# EAGLE schematic composition (EAGLE 7.7.0)
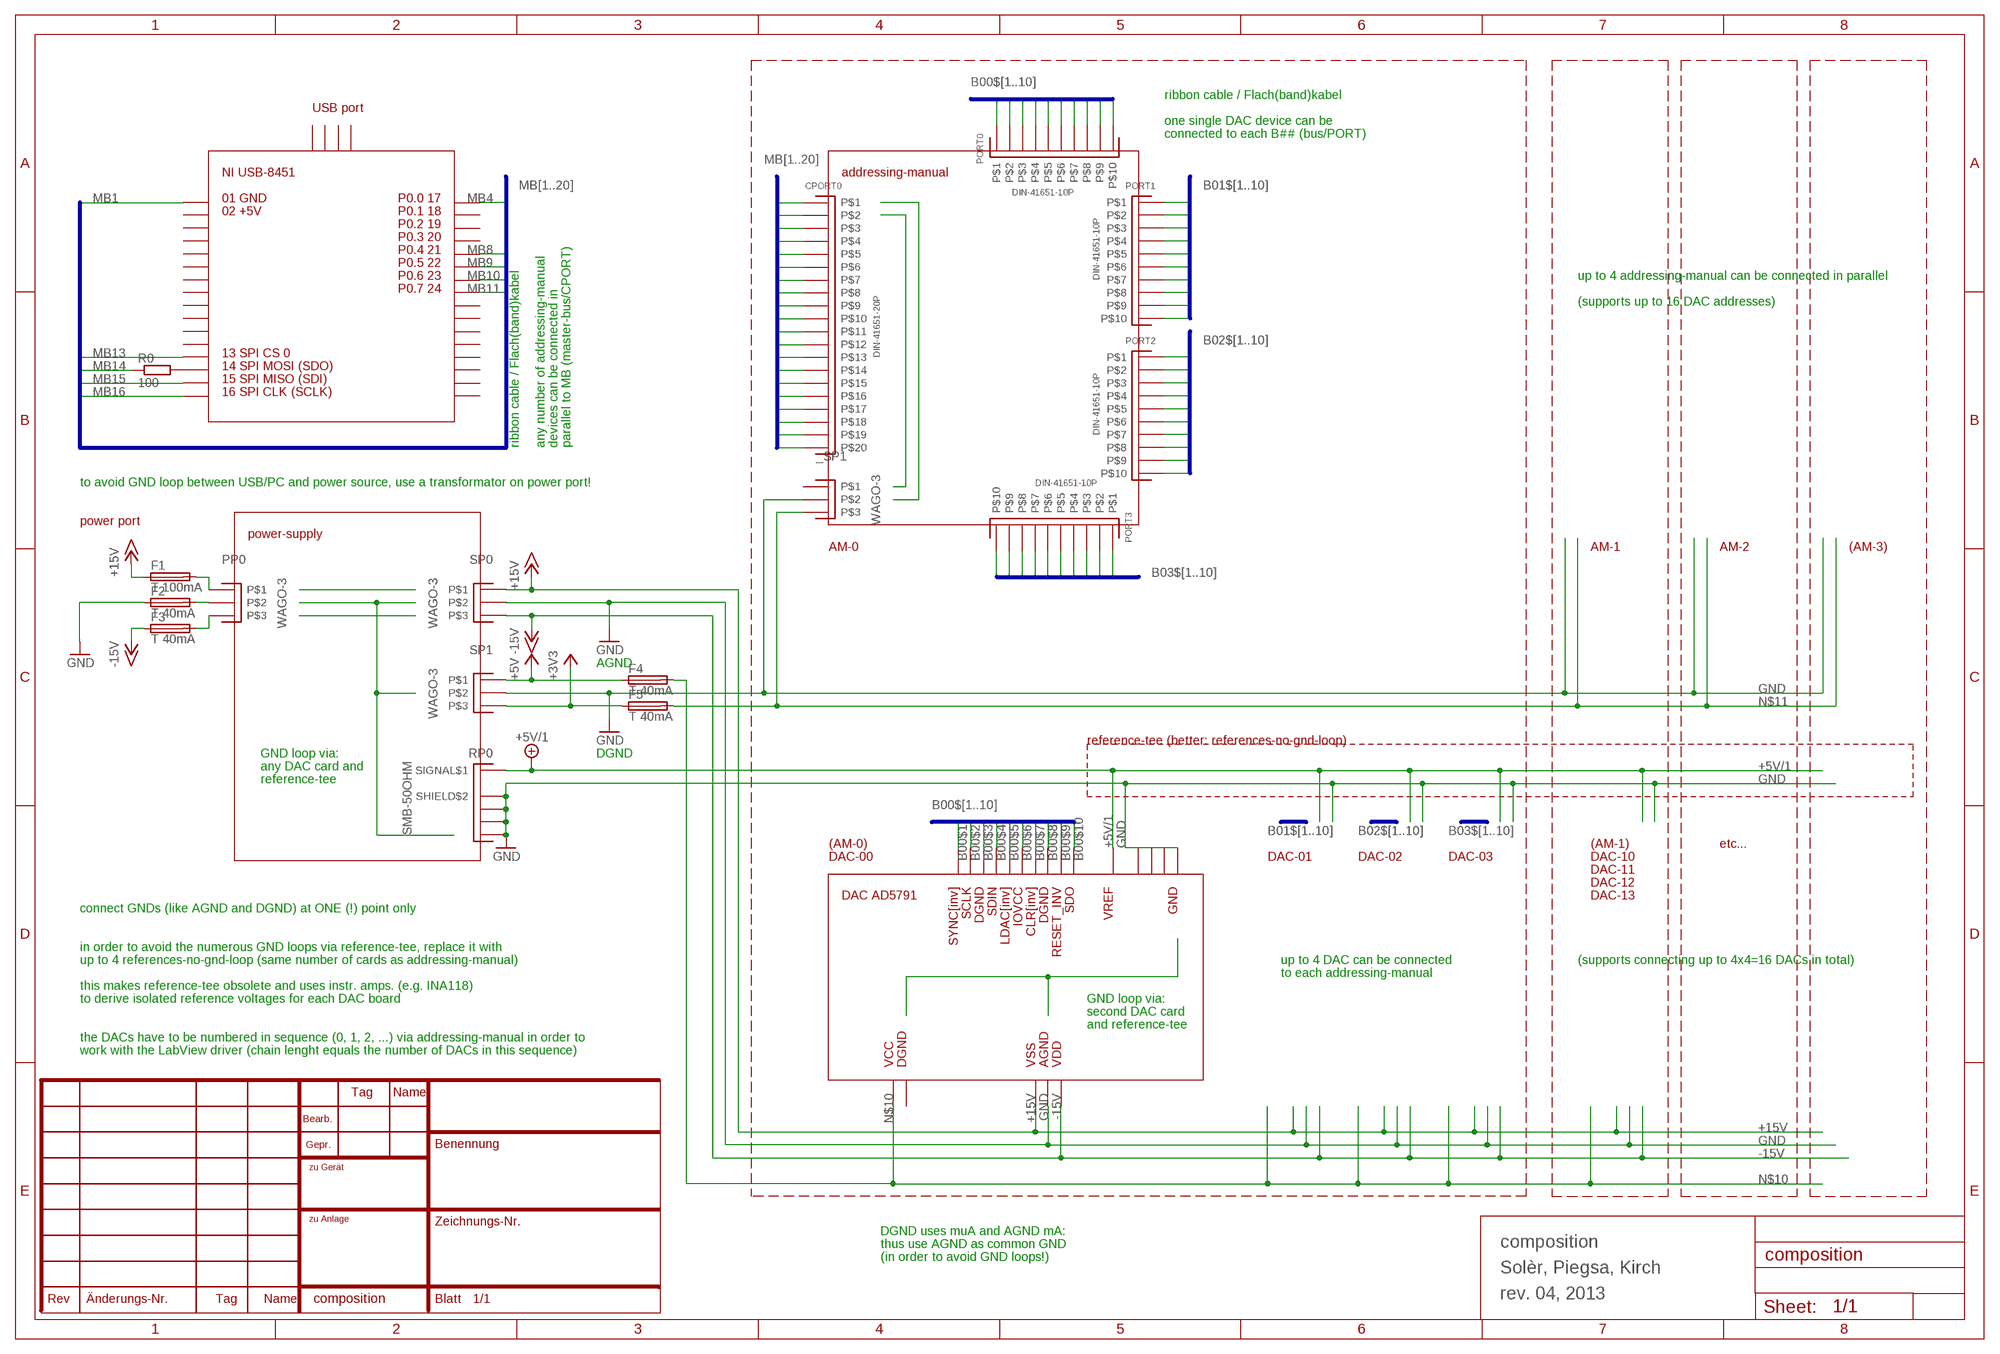
[diagram p0: schematic, sheet 1]

## Parts
_SP1  WAGO-3  [WAGO-3]
CPORT0  DIN-41651-20P  [DIN-41651-20P]
F1  T 100mA  FUSEBLANK_5X20MM  [FUSE_HOLDER_5X20MM]
F2  T 40mA  FUSEBLANK_5X20MM  [FUSE_HOLDER_5X20MM]
F3  T 40mA  FUSEBLANK_5X20MM  [FUSE_HOLDER_5X20MM]
F4  T 40mA  FUSEBLANK_5X20MM  [FUSE_HOLDER_5X20MM]
F5  T 40mA  FUSEBLANK_5X20MM  [FUSE_HOLDER_5X20MM]
PORT0  DIN-41651-10P  [DIN-41651-10P]
PORT1  DIN-41651-10P  [DIN-41651-10P]
PORT2  DIN-41651-10P  [DIN-41651-10P]
PORT3  DIN-41651-10P  [DIN-41651-10P]
PP0  WAGO-3  [WAGO-3]
R0  100  R-EU_0207/12  [0207/12]
RP0  SMB-50OHM  [B-30]
SP0  WAGO-3  [WAGO-3]
SP1  WAGO-3  [WAGO-3]

## Nets
+3V3: F5.1 SP1.P$3
+5V: F4.1 SP1.P$1
+5V/1: RP0.P$1(SIGNAL$1)
+15V: F1.1 SP0.P$1
-15V: F3.1 SP0.P$3
B00$1: PORT0.P$1
B00$2: PORT0.P$2
B00$3: PORT0.P$3
B00$4: PORT0.P$4
B00$5: PORT0.P$5
B00$6: PORT0.P$6
B00$7: PORT0.P$7
B00$8: PORT0.P$8
B00$9: PORT0.P$9
B00$10: PORT0.P$10
B01$1: PORT1.P$1
B01$2: PORT1.P$2
B01$3: PORT1.P$3
B01$4: PORT1.P$4
B01$5: PORT1.P$5
B01$6: PORT1.P$6
B01$7: PORT1.P$7
B01$8: PORT1.P$8
B01$9: PORT1.P$9
B01$10: PORT1.P$10
B02$1: PORT2.P$1
B02$2: PORT2.P$2
B02$3: PORT2.P$3
B02$4: PORT2.P$4
B02$5: PORT2.P$5
B02$6: PORT2.P$6
B02$7: PORT2.P$7
B02$8: PORT2.P$8
B02$9: PORT2.P$9
B02$10: PORT2.P$10
B03$1: PORT3.P$1
B03$2: PORT3.P$2
B03$3: PORT3.P$3
B03$4: PORT3.P$4
B03$5: PORT3.P$5
B03$6: PORT3.P$6
B03$7: PORT3.P$7
B03$8: PORT3.P$8
B03$9: PORT3.P$9
B03$10: PORT3.P$10
GND: _SP1.P$2 F2.1 RP0.P$2(SHIELD$2) RP0.P$3(SHIELD$3) RP0.P$4(SHIELD$4) RP0.P$5(SHIELD$5) SP0.P$2 SP1.P$2
MB1: CPORT0.P$1
MB2: CPORT0.P$2
MB3: CPORT0.P$3
MB4: CPORT0.P$4
MB5: CPORT0.P$5
MB6: CPORT0.P$6
MB7: CPORT0.P$7
MB8: CPORT0.P$8
MB9: CPORT0.P$9
MB10: CPORT0.P$10
MB11: CPORT0.P$11
MB12: CPORT0.P$12
MB13: CPORT0.P$13
MB14: CPORT0.P$14 R0.1
MB15: CPORT0.P$15
MB16: CPORT0.P$16
MB17: CPORT0.P$17
MB18: CPORT0.P$18
MB19: CPORT0.P$19
MB20: CPORT0.P$20
N$7: F1.2 PP0.P$1
N$8: F2.2 PP0.P$2
N$9: F3.2 PP0.P$3
N$10: F4.2
N$11: _SP1.P$3 F5.2
Unconnected: _SP1.P$1 R0.2

## Buses
B01$[1..10]
B02$[1..10]
B03$[1..10]
MB[1..20]
B00$[1..10]

## Notes on the sheet
- ribbon cable / Flach(band)kabel
- USB port
- one single DAC device can be
- connected to each B## (bus/PORT)
- NI USB-8451 | addressing-manual
- 01 GND | P0.0 17
- 02 +5V | P0.1 18
- P0.2 19
- P0.3 20
- P0.4 21
- P0.5 22
- P0.6 23 | up to 4 addressing-manual can be connected in parallel
- P0.7 24
- (supports up to 16 DAC addresses)
- 13 SPI CS 0
- 14 SPI MOSI (SDO)
- 15 SPI MISO (SDI)
- 16 SPI CLK (SCLK)
- ribbon cable / Flach(band)kabel | any number of addressing-manual | devices can be connected in | parallel to MB (master-bus/CPORT)
- to avoid GND loop between USB/PC and power source, use a transformator on power port!
- power port
- power-supply
- AM-0 | AM-1 | AM-2 | (AM-3)
- AGND
- reference-tee (better: references-no-gnd-loop)
- GND loop via: | DGND
- any DAC card and
- reference-tee
- (AM-0) | (AM-1) | etc...
- DAC-00 | DAC-01 | DAC-02 | DAC-03 | DAC-10
- DAC-11
- SYNC[inv] | SCLK | DGND | SDIN | LDAC[inv] | IOVCC | CLR[inv] | DGND | RESET_INV | SDO | VREF | GND | DAC-12
- DAC AD5791 | DAC-13
- connect GNDs (like AGND and DGND) at ONE (!) point only
- in order to avoid the numerous GND loops via reference-tee, replace it with
- up to 4 references-no-gnd-loop (same number of cards as addressing-manual) | up to 4 DAC can be connected | (supports connecting up to 4x4=16 DACs in total)
- to each addressing-manual
- this makes reference-tee obsolete and uses instr. amps. (e.g. INA118)
- to derive isolated reference voltages for each DAC board | GND loop via:
- second DAC card
- and reference-tee
- the DACs have to be numbered in sequence (0, 1, 2, ...) via addressing-manual in order to
- work with the LabView driver (chain lenght equals the number of DACs in this sequence)
- VCC | DGND | VSS | AGND | VDD
- DGND uses muA and AGND mA:
- thus use AGND as common GND | composition
- (in order to avoid GND loops!)
- Solèr, Piegsa, Kirch
- rev. 04, 2013

## Library data of the parts
_SP1 PP0 SP0 SP1 = parts:WAGO-3
CPORT0 = parts:DIN-41651-20P
F1-F5 = fuse:FUSE: Fuse; OC_FARNELL: unknown; OC_NEWARK: unknown
PORT0 PORT1-PORT3 = parts:DIN-41651-10P
R0 = rcl:R-EU_: RESISTOR, European symbol
RP0 = parts:SMB-50OHM